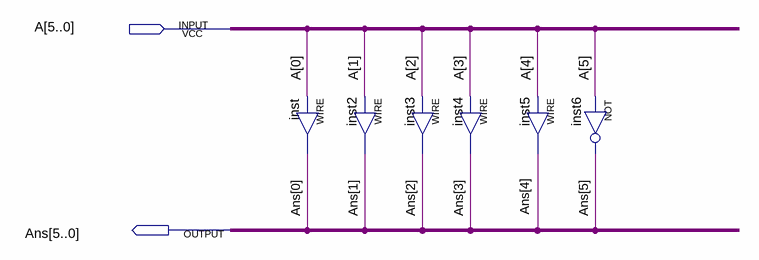
[diagram p0: schematic sheet]
// Quartus schematic invert.bdf as structural Verilog: 6 symbols, 2 pins
module invert (
  input  [5:0] A,
  output [5:0] Ans
);

  assign Ans[0] = A[0];  // WIRE inst
  assign Ans[1] = A[1];  // WIRE inst2
  assign Ans[2] = A[2];  // WIRE inst3
  assign Ans[3] = A[3];  // WIRE inst4
  assign Ans[4] = A[4];  // WIRE inst5
  not inst6 (Ans[5], A[5]);
endmodule
